# EAGLE design TinyRFNode84 (EAGLE 7.2.0)
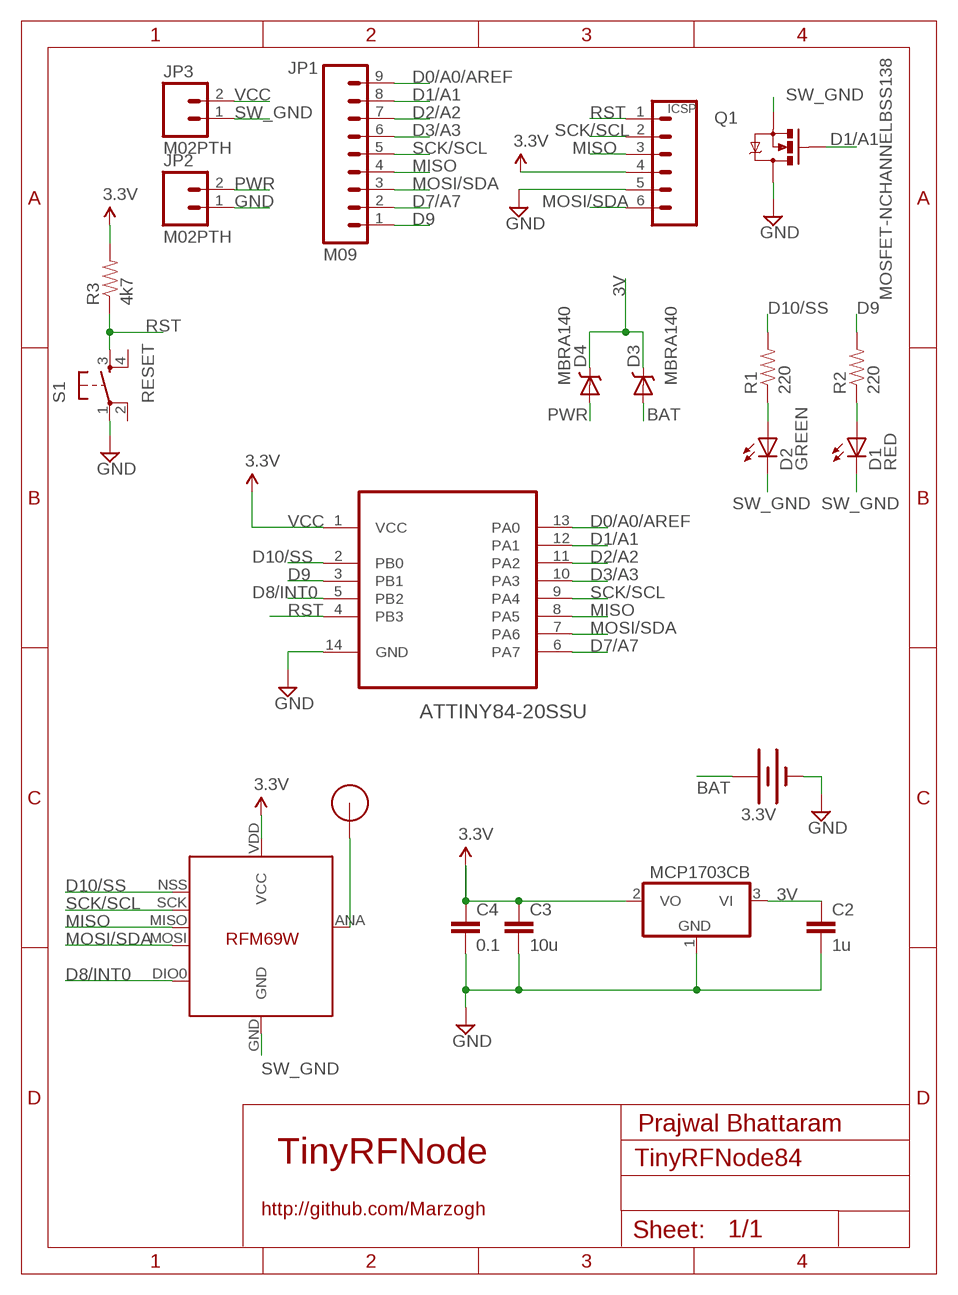
[diagram p0: schematic, sheet 1]

## Parts
BAT1  3.3V  BATTERY12MM  [BATTCON_12MM]
C2  1u  CAP0603-CAP  [0603-CAP]
C3  10u  CAP0805-CAP  [0805-CAP]
C4  0.1  CAP0603-CAP  [0603-CAP]
D1  RED  LED-RED0603  [LED-0603]
D2  GREEN  LED-GREEN0603  [LED-0603]
D3  MBRA140  DIODE-SCHOTTKY-MBRA140  [SMA-DIODE]
D4  MBRA140  DIODE-SCHOTTKY-MBRA140  [SMA-DIODE]
IC3  MCP1703CB  [SOT23]
ICSP  ICSP  M06NO_SILK  [1X06_NO_SILK]
JP1  M09  [1X09]
JP2  M02PTH  [1X02]
JP3  M02PTH  [1X02]
Q1  MOSFET-NCHANNELBSS138  [SOT23]
R1  220  RESISTOR0603-RES  [0603-RES]
R2  220  RESISTOR0603-RES  [0603-RES]
R3  4k7  RESISTOR0402-RES  [0402-RES]
S1  RESET  TAC_SWITCHSMD  [TACTILE-SWITCH-SMD]
U1  ATTINY84-20SSU  [SOIC127P600X175-14N]
U$1  RFM12B_ANTENNA  [RFM12B-ANTENNA]
U$5  RFM69  [RFM69W-MINPADS]

## Nets
3V [power]: C2.1 D3.C D4.C IC3.3(VI)
BAT [power]: BAT1.PWR@1(+) D3.A
D0/A0/AREF: JP1.9 U1.13(PA0)
D1/A1: JP1.8 Q1.1(G) U1.12(PA1)
D2/A2: JP1.7 U1.11(PA2)
D3/A3: JP1.6 U1.10(PA3)
D7/A7: JP1.2 U1.6(PA7)
D8/INT0: U1.5(PB2) U$5.DIO0
D9: JP1.1 R2.2 U1.3(PB1)
D10/SS: R1.2 U1.2(PB0) U$5.NSS(SEL)
GND [power]: BAT1.GND(-) C2.2 C3.2 C4.2 IC3.1(GND) ICSP.5 JP2.1 Q1.3(D) S1.1 U1.14(GND)
MISO: ICSP.3 JP1.4 U1.8(PA5) U$5.MISO
MOSI/SDA: ICSP.6 JP1.3 U1.7(PA6) U$5.MOSI
N$3: U$1.P$1 U$5.ANA(ANT)
N$12: D1.A R2.1
N$13: D2.A R1.1
PWR: D4.A JP2.2
RST: ICSP.1 R3.1 S1.3 U1.4(PB3)
SCK/SCL: ICSP.2 JP1.5 U1.9(PA4) U$5.SCK
SW_GND [power]: D1.C D2.C JP3.1 Q1.2(S) U$5.GND
VCC: C3.1 C4.1 IC3.2(VO) ICSP.4 JP3.2 R3.2 U1.1(VCC) U$5.VDD(VCC) ; supply symbol labelled 3.3V
Unconnected: S1.2 S1.4

## Notes on the sheet
- Prajwal Bhattaram
- TinyRFNode
- http://github.com/Marzogh

## Library data of the parts
BAT1 = SparkFun-Electromechanical:BATTERY: Battery Holders Various common sizes : AA, AAA, 20mm coin cell and 12mm coin cell. 20MM_4LEGS, BATT-10373
C2-C4 = LowPowerLab:CAP: Capacitor Standard 0603 ceramic capacitor, and 0.1" leaded capacitor.
D1 = SparkFun-LED:LED-RED: Assorted Red LEDs LilyPad 1206- DIO-09912 1206- DIO-00809 0603- DIO-00819; PROD_ID: DIO-00819
D2 = SparkFun-LED:LED-GREEN: Various green LEDs Green LEDs used in SFE Production 0603- DIO-00821 LARGE- DIO-00862 LILYPAD- DIO-09910; PROD_ID: DIO-00821
D3 D4 = SparkFun-DiscreteSemi:DIODE-SCHOTTKY: Schottky diodes in SFE's production catalog BAT20J 1A 23V 0.62Vf RB751 120mA 40V 0.37Vf PMEG4005EJ 0.5A 40V 0.42Vf MBRA140 1A 40V 0.5Vf B340A 3A 40V SMA; PROD_ID: DIO-08053
IC3 = linear:MCP1703: 250 mA, 16V, Low Quiescent Current LDO Regulator Source: http://ww1.microchip.com/downloads/en/DeviceDoc/22049b.pdf
ICSP = SparkFun-Connectors:M06: Header 6 Standard 6-pin 0.1" header. Use with straight break away headers (SKU : PRT-00116), right angle break away headers (PRT-00553), swiss pins (PRT-00743), machine pins (PRT-00117), and female headers (PRT-00115). Molex polarized connector foot print use with SKU : PRT-08094 with associated crimp pins and housings. NOTES ON THE VARIANTS LOCK and LOCK_LONGPADS... This footprint was designed to help hold the alignment of a through-hole component (i.e. 6-pin header) while soldering it into place. You may notice that each hole has been shifted either up or down by 0.005 of an inch from it's more standard position (which is a perfectly straight line). This slight alteration caused the pins (the squares in the middle) to touch the edges of the holes. Because they are alternating, it causes a "brace" to hold the component in place. 0.005 has proven to be the perfect amount of "off-center" position when using our standard breakaway headers. Although looks a little odd when you look at the bare footprint, once you have a header in there, the alteration is very hard to notice. Also,if you push a header all the way into place, it is covered up entirely on the bottom side. This idea of altering the position of holes to aid alignment will be further integrated into the Sparkfun Library for other footprints. It can help hold any component with 3 or more connection pins.
JP1 = SparkFun-Connectors:M09: Header 9 Standard 9-pin 0.1" header. Use with straight break away headers (SKU : PRT-00116), right angle break away headers (PRT-00553), swiss pins (PRT-00743), machine pins (PRT-00117), and female headers (PRT-00115).
JP2 JP3 = SparkFun-Connectors:M02: Standard 2-pin 0.1" header. Use with - straight break away headers ( PRT-00116) - right angle break away headers (PRT-00553) - swiss pins (PRT-00743) - machine pins (PRT-00117) - female headers (PRT-00115) Molex polarized connector foot print use with: PRT-08233 with associated crimp pins and housings. 2.54_SCREWTERM for use with PRT-10571. 3.5mm Screw Terminal footprints for PRT-08084 5mm Screw Terminal footprints for use with PRT-08433
Q1 = SparkFun-DiscreteSemi:MOSFET-NCHANNEL: Common NMOSFET Parts MFG P/N Store ID Prod ID FDD8780 TRANS-09984 SI7820DN TRANS-11055 FDS6630A IC-08089 2N7002PW TRANS-11151 FQP30N06L COM-10213 TRANS-10060 BSS123LT1G TRANS-08345 BSS138 TRANS-00830 BS170 2N7000; PROD_ID: TRANS-00830
R1-R3 = SparkFun-Passives:RESISTOR: Resistor Basic schematic elements and footprints for 0603, 1206, and PTH resistors.
S1 = SparkFun-Electromechanical:TAC_SWITCH: Momentary Switch Button commonly used for reset or general input. Spark Fun Electronics SKU : COM-00097 SMT- SWCH-08247
U1 = Atmel:ATTINY84-20SSU: 8-bit Microcontroller with Bytes In-System Programmable Flash; MPN: ATTINY84-20SSU; OC_FARNELL: 1636955; OC_NEWARK: 03P2040; PACKAGE: SOIC-14; SUPPLIER: Atmel
U$1 = LowPowerLab:RFM12B_ANTENNA
U$5 = LowPowerLab:RFM69

## Net classes
1 power: width 0.381 mm, clearance 0.254 mm

## Board
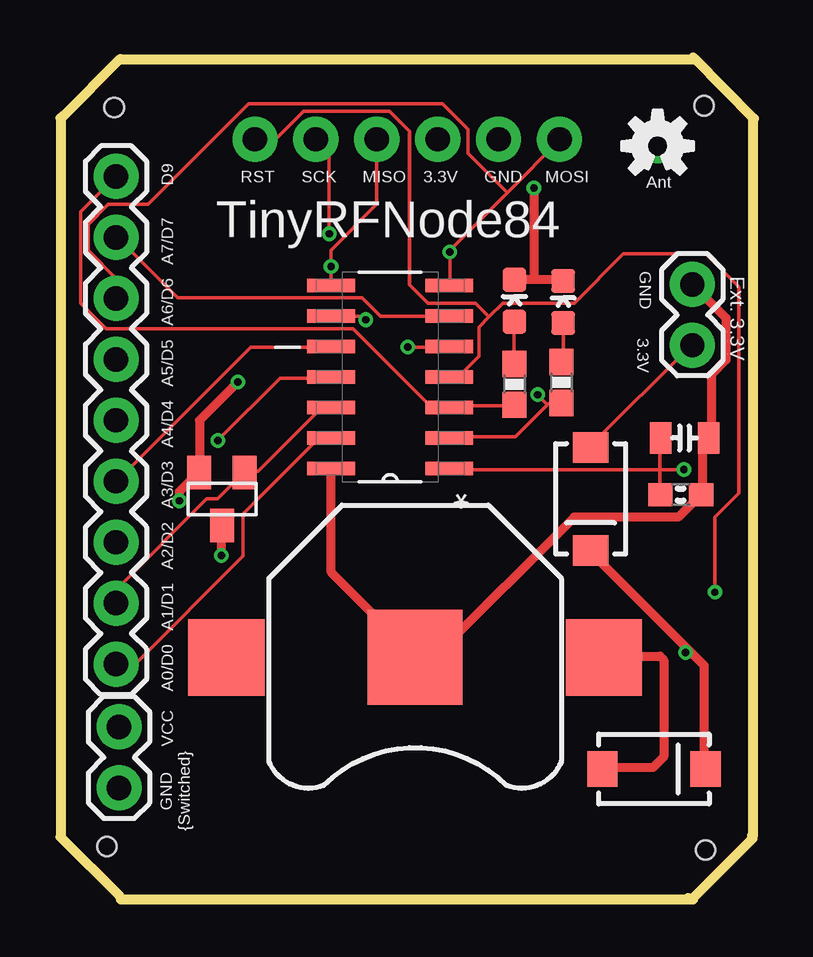
[diagram p1: board, top side]
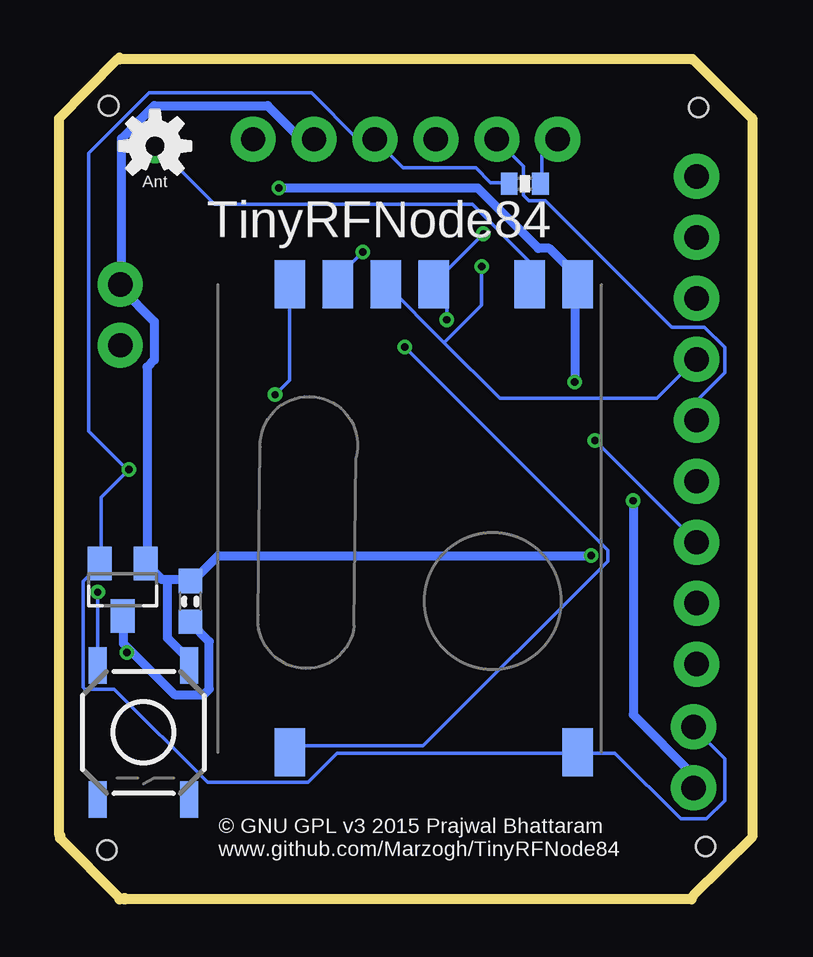
[diagram p2: board, bottom side, seen from below]

Size 28.88 x 34.87 mm. Coordinates in mm from the lower left corner, seen from the top.
Outline: 0,32.44 0,2.44 2.44,0 26.44,0 28.88,2.44 28.88,32.41 26.42,34.87 2.46,34.87 0.03,32.44
Copper layers (1*16): Top 0.035mm / dielectric 1.5mm / Bottom 0.035mm
Design rules "Seeed_rules": minimum track width 6mil, minimum drill 12mil, track to track 6mil, track to pad 6mil, pad to pad 6mil, via to via 6mil, smd to smd 0mil, copper to edge 10mil, drill to drill 10mil, minimum pad ring 10mil, minimum via ring 6mil, stop-mask expansion 2mil, vias tented up to drill 100mil, thermal gap 10mil
Holes 0.8 mm at 2.26,32.89 26.85,32.97 1.96,2.11 26.92,1.96
tRestrict: area 20.1,5.9 to 24.9,9.8; area 1.7,13.9 to 2.7,15.5; area 1,6.7 to 2.6,7.4
bRestrict: area 23.3,14.7 to 25,15.7; area 16.9,10.8 to 18.7,11.9; area 17.4,9.6 to 17.9,10.2; area 16.5,9.6 to 17,10.2; area 16,9.8 to 16.5,10.5; area 16,10.4 to 16.5,11; area 22.4,15.9 to 22.9,16.5; area 22.4,14.9 to 22.9,15.5; area 23.4,16.1 to 23.9,16.8; area 23.8,15.8 to 24.9,16.6
Milling: 13 lines

### Footprints (pad centres in the part's own frame; a part is rotated, then mirrored left to right if it is on the bottom)
BATTCON_12MM = smd 3.962 x 3.962: GND 0,0 | smd 3.175 x 3.175: PWR@1 -7.874,0; PWR@2 7.874,0
0603-CAP = smd 1.016 x 0.965: 1 -0.85,0; 2 0.85,0
0805-CAP = smd 0.902 x 1.3: 1 -1,0; 2 1,0
LED-0603 = smd 1 x 1: A 0,-0.877; C 0,0.877
SMA-DIODE = smd 1.27 x 1.47: A -2.15,0; C 2.15,0
SOT23 = smd 1 x 1.4: 1 -0.95,-1.1; 2 0.95,-1.1; 3 0,1.1
1X06_NO_SILK = drill 1.016 pad 1.88: 1 0,0; 2 2.54,0; 3 5.08,0; 4 7.62,0; 5 10.16,0; 6 12.7,0
1X09 = drill 1.016 pad 1.88: 1 0,0; 2 2.54,0; 3 5.08,0; 4 7.62,0; 5 10.16,0; 6 12.7,0; 7 15.24,0; 8 17.78,0; 9 20.32,0
1X02 = drill 1.016 pad 1.88: 1 0,0; 2 2.54,0
0603-RES = smd 1.1 x 1: 1 -0.85,0; 2 0.85,0
0402-RES = smd 0.7 x 0.9: 1 -0.65,0; 2 0.65,0
TACTILE-SWITCH-SMD = smd 1.524 x 0.762: 1 -2.794,1.905; 2 2.794,1.905; 3 -2.794,-1.905; 4 2.794,-1.905
SOIC127P600X175-14N = smd 1.981 x 0.559: 1 -2.464,3.81; 2 -2.464,2.54; 3 -2.464,1.27; 4 -2.464,0; 5 -2.464,-1.27; 6 -2.464,-2.54; 7 -2.464,-3.81; 8 2.464,-3.81; 9 2.464,-2.54; 10 2.464,-1.27; 11 2.464,0; 12 2.464,1.27; 13 2.464,2.54; 14 2.464,3.81
RFM12B-ANTENNA = drill 0.8 pad 1.422: P$1 0,0
RFM69W-MINPADS = smd 2 x 1.27: ANA 8,-5; DIO0 -11.5,5; GND 8,-7; MISO 8,1; MOSI 8,3; NSS 8,5; SCK 8,-1; VDD -11.5,-7

### Placement (x,y rotation side)
BAT1  14.81,9.98 180 top
C2  23.44,12.32 90 bottom
C3  26.04,19.13 0 top
C4  25.88,16.76 0 top
D1  18.95,24.84 0 top
D2  20.98,24.79 0 top
D3  24.76,5.33 0 top
D4  22.12,16.59 270 top
IC3  26.26,12.8 180 bottom
ICSP  8.13,31.57 0 top
JP1  2.34,30.02 270 top
JP2  26.37,25.53 270 top
JP3  2.46,4.55 90 top
Q1  6.76,16.59 180 top
R1  20.9,21.44 270 top
R2  18.95,21.36 270 top
R3  9.5,29.72 180 bottom
S1  25.4,6.86 270 bottom
U1  13.77,21.67 180 top
U$1  24.92,31.29 270 top
U$2  [OSHW-LOGO-S]  24.92,31.29 0 bottom
U$3  [OSHW-LOGO-S]  24.92,31.29 0 top
U$5  14.3,17.53 90 bottom

### Tracks (layer width: path | path; a pad name or v marks a point on that pad's centre or on a via)
3V  (via drill 0.3)
  Top 0.381: 26.2,10.3 22.12,14.38 D4.C | 26.2,10.3 26.85,9.65 26.85,5.38 D3.C | v26.09,10.19 26.2,10.3
  Bottom 0.381: 25.97,10.3 26.24,10.57 26.24,11.63 IC3.3 | 25.97,10.3 24.1,8.43 22.89,8.43 22.66,8.66 22.66,10.64 23.42,11.4 C2.1 | v26.09,10.19 25.97,10.3
BAT
  Top 0.381: D3.A 22.66,5.38 24.71,5.38 25.17,5.84 25.17,9.88 25.02,10.03 22.73,10.03 BAT1.PWR@1
D0/A0/AREF
  Top 0.152: U1.13 11.3,19.1 10.77,19.1 7.65,15.98 7.65,14.22 3.15,9.73 2.39,9.73 JP1.9
D1/A1
  Top 0.152: U1.12 10.92,20.4 8.26,17.73 7.72,17.73 Q1.1 7.65,17.65 6.58,16.59 6.12,16.59 2.39,12.85 2.39,12.24 JP1.8
D2/A2  (via drill 0.3)
  Top 0.152: v6.58,19.02 9.17,21.62 11.3,21.62 U1.11
  Bottom 0.152: JP1.7 v6.58,19.02
D3/A3
  Top 0.152: U1.10 11.3,22.91 7.95,22.91 2.39,17.35 JP1.6
D7/A7
  Top 0.152: U1.6 13.36,24.21 12.6,24.97 4.9,24.97 2.39,27.48 JP1.2
D8/INT0  (via drill 0.3)
  Top 0.152: v14.5,22.91 16.18,22.91 U1.5
  Bottom 0.152: v14.5,22.91 6.05,14.45 6.05,14 13.74,6.3 19,6.3 19.23,6.07 U$5.DIO0
D9
  Top 0.152: R2.2 18.92,20.47 16.33,20.47 16.26,20.4 U1.3 15.49,20.4 12.22,23.67 1.93,23.67 0.86,24.74 0.86,28.55 JP1.1
D10/SS  (via drill 0.3)
  Top 0.152: 20.33,20.51 19,19.18 16.26,19.18 U1.2 | 20.33,20.51 20.37,20.55 20.9,20.55 R1.2 | 20.33,20.51 v19.91,20.93
  Bottom 0.152: v19.91,20.93 19.3,21.54 19.3,25.5 U$5.NSS
GND  (via drill 0.3)
  Top 0.381: v6.73,14.22 6.73,15.44 Q1.3 | U1.14 11.3,13.54 14.81,10.03 BAT1.GND 14.96,10.11 15.72,10.11 21.44,15.82 25.78,15.82 26.62,16.66 C4.2 26.77,16.81 26.77,18.87 27,19.1 C3.2 27.15,19.25 27.15,21.77 27.76,22.38 27.76,24.13 JP2.1
  Bottom 0.381: 24.41,13.23 24.64,13.23 25.25,13.84 IC3.1 25.25,14.07 25.25,22.07 24.94,22.38 24.94,23.98 26.31,25.35 JP2.1 26.31,25.58 26.31,31.6 24.94,32.97 20.22,32.97 18.85,31.6 18.31,31.6 ICSP.5 | 24.41,13.23 23.5,13.23 C2.2 23.27,13.23 22.28,14.22 v6.73,14.22 | S1.1 23.5,9.88 24.41,10.79 24.41,13.23
MISO  (via drill 0.3)
  Top 0.152: U1.8 v11.3,26.26 11.3,26.95 13.21,28.85 ICSP.3
  Bottom 0.152: 12.87,23.1 10.54,20.78 3.99,20.78 2.39,22.38 JP1.4 | 12.87,23.1 15.27,25.5 U$5.MISO | v11.3,26.26 11.3,24.66 12.87,23.1
MOSI/SDA  (via drill 0.3)
  Top 0.152: 18.66,29.35 20.83,31.52 ICSP.6 | 18.66,29.35 16.26,26.95 v16.26,26.87 16.26,25.5 U1.7 | 18.66,29.35 17.02,30.99 17.02,31.98 15.95,33.05 7.87,33.05 3.68,28.85 2.01,28.85 1.17,28.02 1.17,26.95 2.31,25.81 2.31,24.97 JP1.3
  Bottom 0.152: v16.26,26.87 17.25,25.88 17.25,25.58 U$5.MOSI
N$3
  Bottom 0.152: U$5.ANA 9.32,25.58 9.32,26.49 11.68,28.85 22.43,28.85 24.87,31.29 U$1.P$1
N$12
  Top 0.152: D1.A 18.92,23.9 18.92,22.22 R2.1
N$13
  Top 0.152: D2.A 20.98,22.38 20.9,22.3 R1.1
PWR
  Top 0.152: D4.A 22.12,18.8 26.31,22.99 JP2.2
RST  (via drill 0.3)
  Top 0.152: v27.31,12.7 27.31,15.82 28.3,16.81 28.3,25.43 26.92,26.8 23.5,26.8 21.44,24.74 18.47,24.74 17.89,24.17 | 17.89,24.17 17.48,23.75 17.48,22.53 16.64,21.69 16.26,21.69 U1.4 | 17.89,24.17 17.32,24.74 15.34,24.74 14.58,25.5 14.58,31.9 13.74,32.74 10.16,32.74 9.02,31.6 8.18,31.6 ICSP.1
  Bottom 0.152: ICSP.1 8.79,30.91 8.79,29.77 R3.1 | v27.31,12.7 S1.3
SCK/SCL  (via drill 0.3)
  Top 0.152: U1.9 12.6,24.21 v12.75,24.05 | v11.23,27.63 11.23,30.99 10.69,31.52 ICSP.2
  Bottom 0.152: v12.75,24.05 12.75,24.97 13.28,25.5 U$5.SCK 13.28,25.58 v11.23,27.63 | ICSP.2 9.55,30.45 9.55,29.24 9.32,29.01 8.64,29.01 3.38,23.75 2.01,23.75 1.17,22.91 1.17,21.84 2.31,20.7 2.31,19.86 JP1.5
SW_GND  (via drill 0.3)
  Top 0.381: 19.76,25.73 19,25.73 D1.C | 19.76,25.73 20.98,25.73 D2.C | v7.42,21.46 5.82,19.86 5.82,17.73 Q1.2 5.66,17.58 4.98,16.89 v4.98,16.51 | v19.76,29.54 19.76,25.73
  Bottom 0.381: v7.42,21.46 7.42,25.43 7.34,25.5 U$5.GND 7.42,25.65 7.42,25.96 8.48,27.03 8.94,27.03 11.46,29.54 v19.76,29.54 | JP3.1 2.46,5.08 4.98,7.59 v4.98,16.51
VCC  (via drill 0.3)
  Top 0.152: 16.26,17.88 U1.1 16.26,17.81 25.02,17.81 | 25.02,17.81 25.02,19.1 C3.1 | 25.02,17.81 25.02,16.81 C4.1 | 25.02,17.81 v26.01,17.81
  Bottom 0.152: JP3.2 2.46,7.06 1.17,5.77 1.17,4.01 1.93,3.25 3,3.25 5.74,5.99 7.26,5.99 U$5.VDD 7.34,5.99 17.32,5.99 18.54,4.77 22.73,4.77 26.62,8.66 27.84,8.66 27.91,8.74 27.91,13.16 27.23,13.84 IC3.2 27.15,13.92 27.15,16.66 v26.01,17.81 26.09,17.81 27.69,19.41 27.69,30.99 25.17,33.5 18.39,33.5 16.48,31.6 15.8,31.6 ICSP.4 15.72,31.52 14.58,30.38 11.53,30.38 10.92,29.77 10.16,29.77 R3.2

### Text on the board
_tsilk: D9 | RST | SCK | MISO | 3.3V | GND | MOSI | Ant | TinyRFNode84 | A7/D7 | GND | Ext. 3.3V | A6/D6 | 3.3V | A5/D5 | A4/D4 | A3/D3 | A2/D2 | A1/D1 | A0/D0 | VCC | GND / {Switched}
_bsilk: Ant | TinyRFNode84 | © GNU GPL v3 2015 Prajwal Bhattaram / www.github.com/Marzogh/TinyRFNode84